# Altium schematic sheet Sheet1.SchDoc
size A4
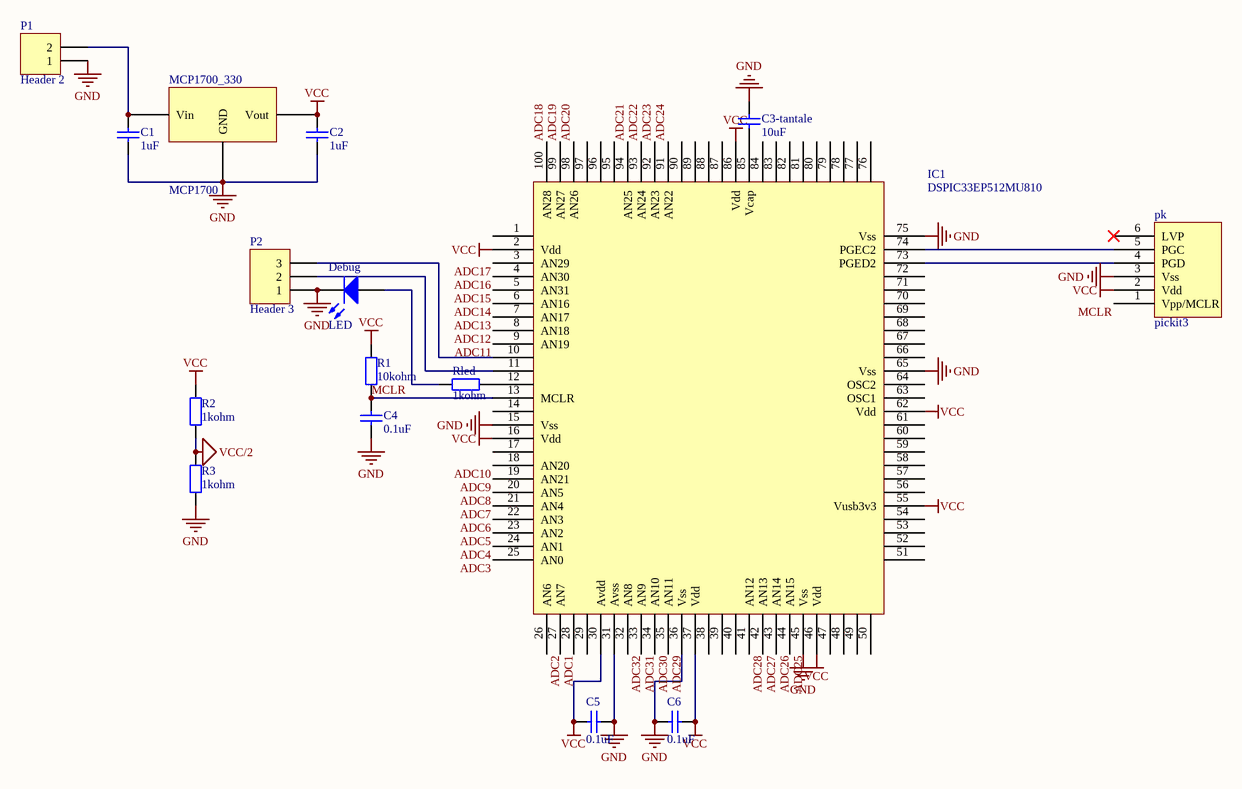
[diagram p0: Sheet1.SchDoc]

## Parts
C1  1uF  [cms805 - mini]
C2  1uF  [cms805 - mini]
C3-tantale  10uF  [cms805]
C4  0.1uF  [cms805 - mini]
C5  0.1uF  [cms805 - mini]
C6  0.1uF  [cms805 - mini]
Debug  LED  [cms1206]
IC1  DSPIC33EP512MU810  [TQFP100PF]
MCP1700_330  MCP1700  [SOT89]
P1  Header 2  [HDR1X2]
P2  Header 3  [HDR1X3]
pk  pickit3  [pickit3]
R1  10kohm  [cms805 - mini]
R2  1kohm  [cms805 - mini]
R3  1kohm  [cms805 - mini]
Rled  1kohm  [cms805 - mini]

## Nets
GND: C1.1 C2.1 C3-tantale.2 C4.1 C5.1 C6.2 Debug.2(K) IC1.15(Vss) IC1.31(Avss) IC1.36(Vss) IC1.45(Vss) IC1.65(Vss) IC1.75(Vss) MCP1700_330.1(GND) P1.1 P2.1 pk.3(Vss) R3.1
VCC: C2.2 C5.2 C6.1 IC1.2(Vdd) IC1.16(Vdd) IC1.30(Avdd) IC1.37(Vdd) IC1.46(Vdd) IC1.55(Vusb3v3) IC1.62(Vdd) IC1.86(Vdd) MCP1700_330.3(Vout) pk.2(Vdd) R1.2 R2.2
VCC/2: R2.1 R3.2
ADC1: IC1.27(AN7)
ADC2: IC1.26(AN6)
ADC3: IC1.25(AN0)
ADC4: IC1.24(AN1)
ADC5: IC1.23(AN2)
ADC6: IC1.22(AN3)
ADC7: IC1.21(AN4)
ADC8: IC1.20(AN5)
ADC9: IC1.19(AN21)
ADC10: IC1.18(AN20)
ADC11: IC1.9(AN19)
ADC12: IC1.8(AN18)
ADC13: IC1.7(AN17)
ADC14: IC1.6(AN16)
ADC15: IC1.5(AN31)
ADC16: IC1.4(AN30)
ADC17: IC1.3(AN29)
ADC18: IC1.100(AN28)
ADC19: IC1.99(AN27)
ADC20: IC1.98(AN26)
ADC21: IC1.94(AN25)
ADC22: IC1.93(AN24)
ADC23: IC1.92(AN23)
ADC24: IC1.91(AN22)
ADC25: IC1.44(AN15)
ADC26: IC1.43(AN14)
ADC27: IC1.42(AN13)
ADC28: IC1.41(AN12)
ADC29: IC1.35(AN11)
ADC30: IC1.34(AN10)
ADC31: IC1.33(AN9)
ADC32: IC1.32(AN8)
MCLR: C4.2 IC1.13(MCLR) pk.1(Vpp/MCLR) R1.1
NetC1_2: C1.2 MCP1700_330.2(Vin) P1.2
NetC3-tantale_1: C3-tantale.1 IC1.85(Vcap)
NetDebug_1: Debug.1(A) Rled.2
NetIC1_10: IC1.10 P2.3
NetIC1_11: IC1.11 P2.2
NetIC1_12: IC1.12 Rled.1
NetIC1_73: IC1.73(PGED2) pk.4(PGD)
NetIC1_74: IC1.74(PGEC2) pk.5(PGC)

Not connected (* = marked no-connect by the designer): IC1 1 14 17 28 29 38 39 40 47 48 49 50 51 52 53 54 56 57 58 59 60 61 63(OSC1) 64(OSC2) 66 67 68 69 70 71 72 76 77 78 79 80 81 82 83 84 87 88 89 90 95 96 97; pk 6(LVP)*

## Library data of the parts
C1 C2 C3-tantale C4-C6 = Capa
P1 = Header 2: Header, 2-Pin; LatestRevisionDate: 17-Jul-2002; LatestRevisionNote: Re-released for DXP Platform.; Publisher: Altium Limited
P2 = Header 3: Header, 3-Pin; LatestRevisionDate: 17-Jul-2002; LatestRevisionNote: Re-released for DXP Platform.; Publisher: Altium Limited
R1-R3 Rled = Resistance